# Altium schematic sheet LPEDT_revA1_bikeit_POWER.SchDoc: Bike It Power Management (part 2 of 3)
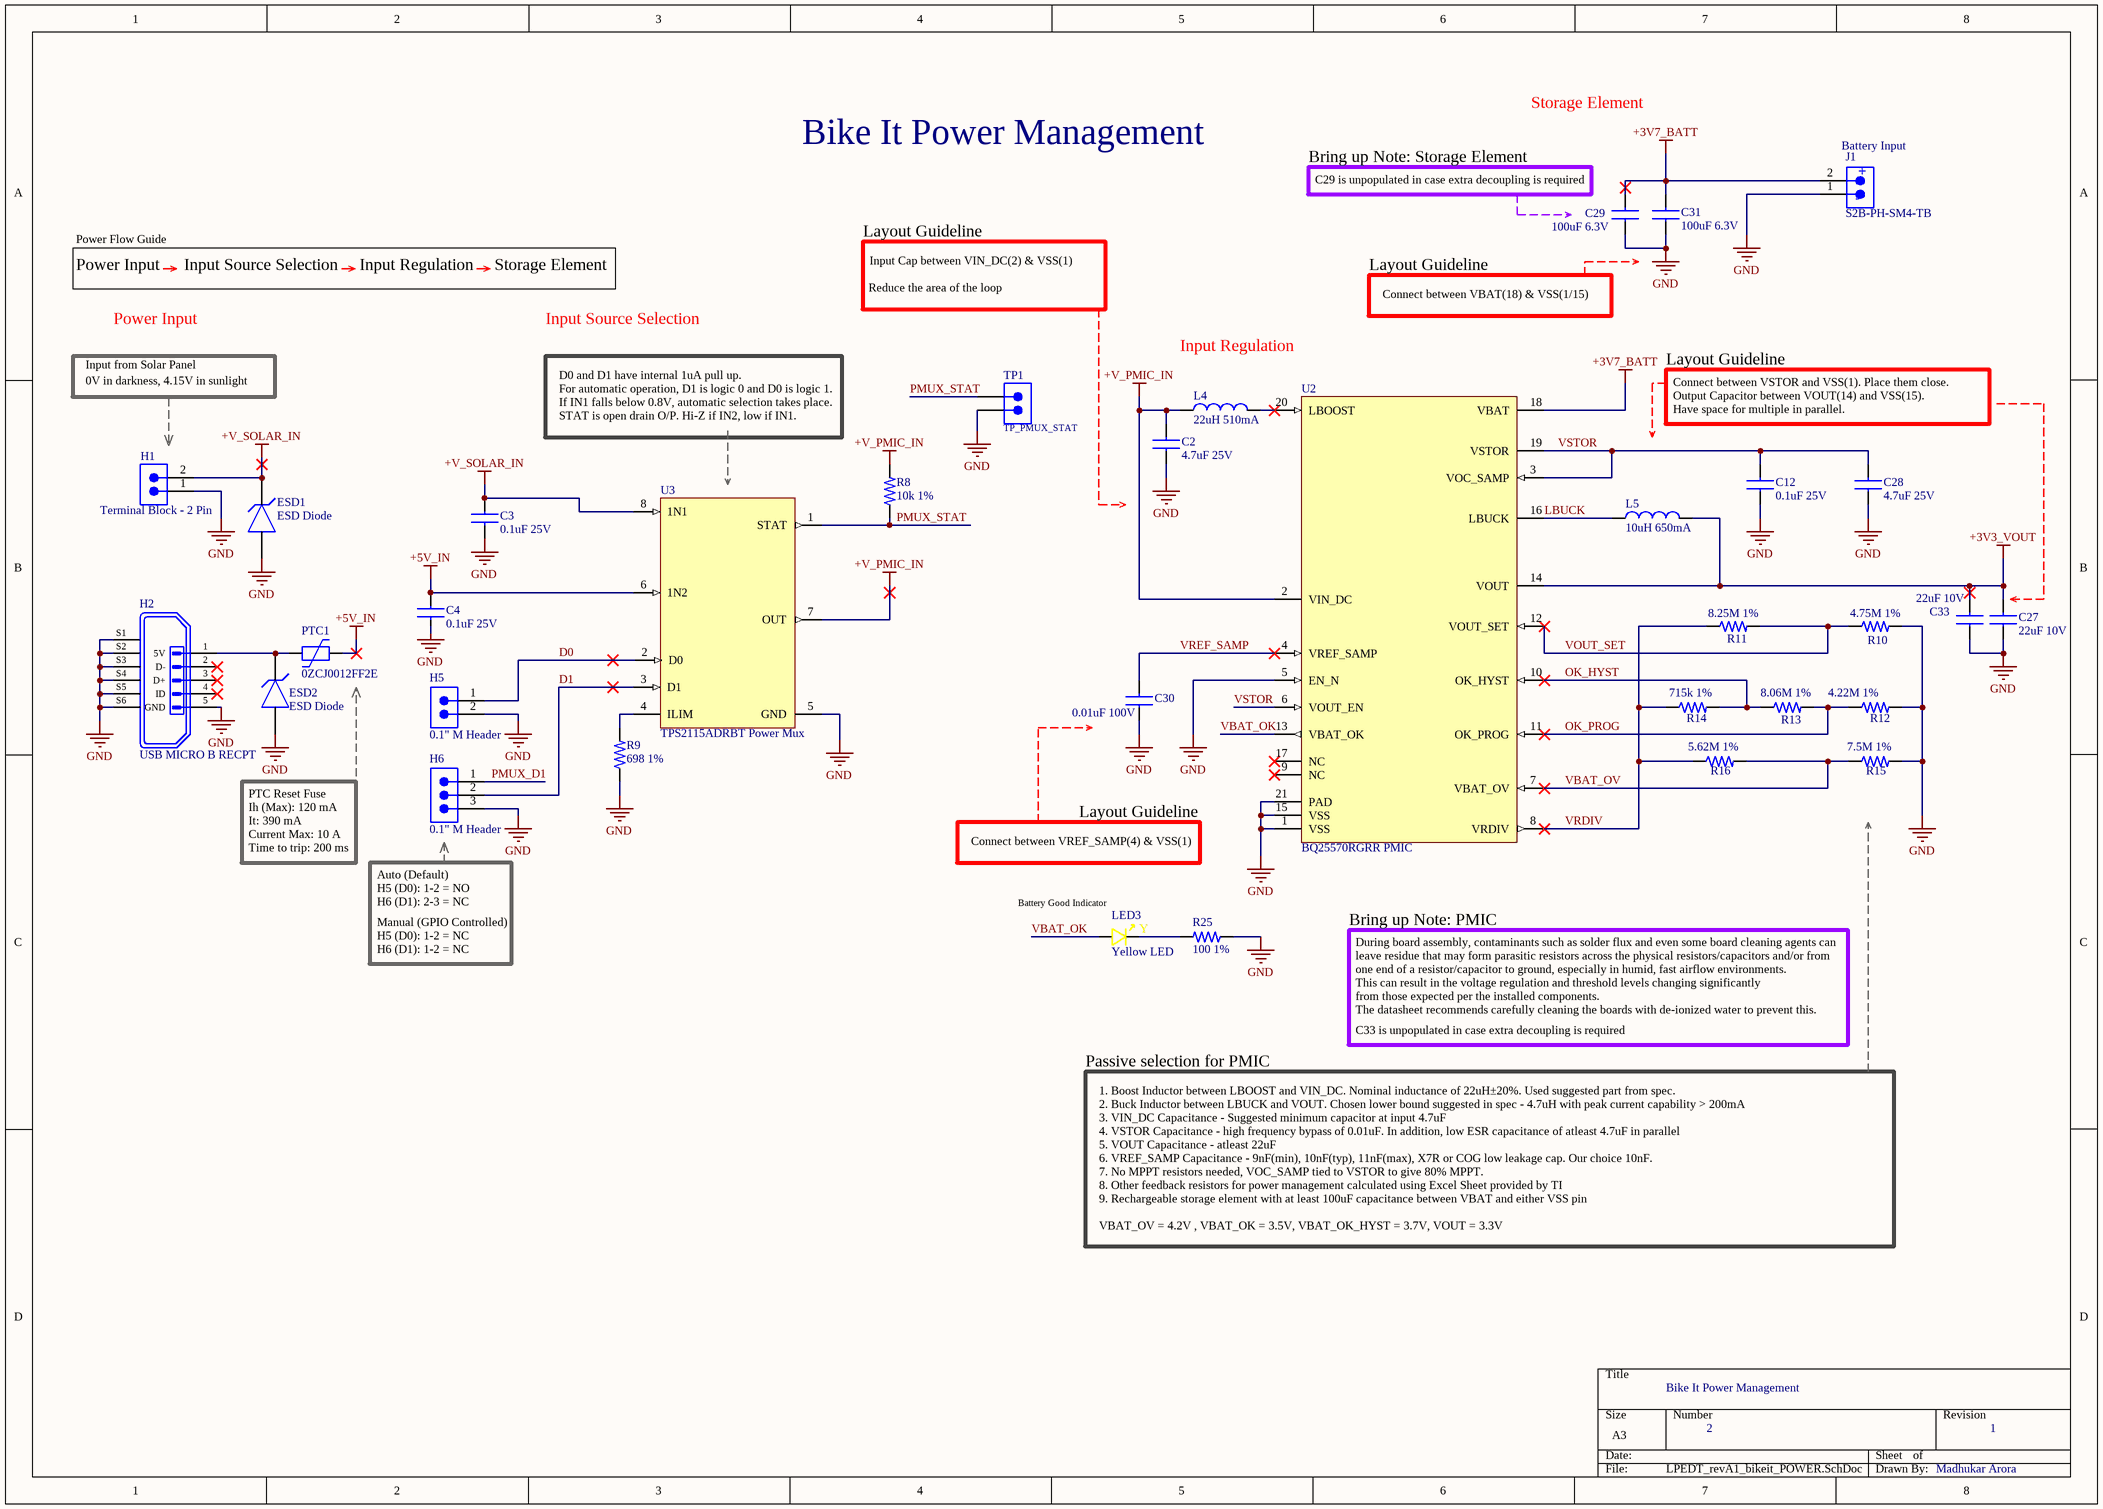
[diagram p1: LPEDT_revA1_bikeit_POWER.SchDoc]
## Library data of the parts
C2 C28 = GRM188R61E475KE11D: Cap Ceramic 0603 4.7 uF 25 V ±10 % Tolerance X5R SMT Multilayer Ceramic Capacitor; Manufacturer: Murata; Tolerance: 10%; Supplier 1: Digi-Key; Manufacturer Part Number: GRM188R61E475KE11D; RoHS: Yes; Category: Ceramic Capacitors; Stock 1: 307528; Pricing 1: 1=0.36000, 10=0.24700, 50=0.17280, 100=0.14820, 500=0.11112, 1000=0.09384 (USD); Mount: Surface Mount; Case/Package: 0603; Case Code (Metric): 1608; Case Code (Imperial): 0603; Material: Ceramic; Min Operating Temperature: -55°C; Max Operating Temperature: 85°C; Package Quantity: 4000; Packaging: Cut Tape; Capacitance: 4.7uF; Voltage Rating: 25V; Dielectric: X5R; Voltage: 25V; Voltage Rating (DC): 25V; Series: GRM; Length: 1.6mm; Width: 0.031inch; Height: 0.8mm; Thickness: 0.031inch; Depth: 0.8mm; REACH SVHC: No SVHC; Lead Free: Lead Free; RoHS Compliant: Yes; ComponentLink1URL: https://datasheet.ciiva.com/46444/1769893-46444982.pdf?src-supplier=Element14; ComponentLink1Description: https://datasheet.ciiva.com/46444/1769893-46444982.pdf?src-supplier=Element14; ComponentLink2URL: https://datasheet.ciiva.com/46444/1769893-46444983.pdf?src-supplier=Element14; ComponentLink2Description: https://datasheet.ciiva.com/46444/1769893-46444983.pdf?src-supplier=Element14; ComponentLink3URL: https://datasheet.ciiva.com/14891/partnumbering-e-01-14891103.pdf?src-supplier=Digi-Key; ComponentLink3Description: https://datasheet.ciiva.com/14891/partnumbering-e-01-14891103.pdf?src-supplier=Digi-Key; ComponentLink4URL: https://datasheet.ciiva.com/14891/partnumbering-e-01-14891102.pdf?src-supplier=Digi-Key; ComponentLink4Description: https://datasheet.ciiva.com/14891/partnumbering-e-01-14891102.pdf?src-supplier=Digi-Key; Supplier Part Number 1: 490-7203-1-ND
C3 C4 C12 = GCJ188R71E104KA12D: CAP CER 0.1UF 25V X7R 0603; Manufacturer: Murata; Capacitance: 100nF; Tolerance: 10%; Supplier 1: Mouser; Manufacturer Part Number: GCJ188R71E104KA12D; RoHS: Yes; Category: Ceramic Capacitors; Stock 1: 1672; Pricing 1: 1=0.21000, 10=0.14900, 50=0.08480, 100=0.07030, 500=0.04928, 1000=0.04080 (USD); Mount: Surface Mount; Case/Package: 0603; Case Code (Imperial): 0603; Case Code (Metric): 1608; Min Operating Temperature: -55°C; Max Operating Temperature: 125°C; Features: Soft Termination; Packaging: Tape and Reel; Voltage Rating: 25V; Ratings: AEC-Q200; RoHS Compliant: Yes; ComponentLink1URL: http://search.murata.co.jp/Ceramy/image/img/A01X/G101/ENG/GCJ188R71E104KA12-01.pdf?src-supplier=Digi-Key; ComponentLink1Description: http://search.murata.co.jp/Ceramy/image/img/A01X/G101/ENG/GCJ188R71E104KA12-01.pdf?src-supplier=Digi-Key; Supplier Part Number 1: 81-GCJ188R71E104KA2D
C27 C33 = GRM187R61A226ME15D: Cap Ceramic 0603 22 uF 10 V ±20% Tolerance X5R Multilayer Ceramic Chip Capacitor; Manufacturer: Murata; Manufacturer Part Number: GRM188R61A226ME15D; RoHS: Yes; Category: Ceramic Capacitors; Stock 1: 1378902; Pricing 1: 1=0.30000, 10=0.20500, 50=0.13680, 100=0.11630, 500=0.08210, 1000=0.07184 (USD); Mount: Surface Mount; Case/Package: 0603; Case Code (Metric): 1608; Case Code (Imperial): 0603; Material: Ceramic; Weight: 0.000222oz; Min Operating Temperature: -55°C; Max Operating Temperature: 85°C; Capacitance: 22uF; Tolerance: 20%; Voltage Rating: 10V; Packaging: Tape and Reel; Dielectric: X5R; Termination: SMD/SMT; Voltage Rating (DC): 10V; Package Quantity: 4000; Length: 1.6mm; Width: 0.8mm; Height: 0.8mm; Thickness: 0.039inch; Depth: 0.8mm; REACH SVHC: No SVHC; Lead Free: Lead Free; RoHS Compliant: Yes; ComponentLink1URL: https://datasheet.ciiva.com/46444/1769893-46444975.pdf?src-supplier=Element14; ComponentLink1Description: https://datasheet.ciiva.com/46444/1769893-46444975.pdf?src-supplier=Element14; Supplier 1: Digi-Key
C29 C31 = CL31A107MQHNNNE: Cap Ceramic 100uF 6.3V X5R 20% SMD 1206 85°C Embossed T/R; Manufacturer: Samsung; Supplier 1: Digi-Key; Manufacturer Part Number: CL31A107MQHNNNE; RoHS: Yes; Category: Ceramic Capacitors; Stock 1: 161626; Pricing 1: 1=0.57000, 10=0.40300, 50=0.30480, 100=0.26540, 500=0.19662, 1000=0.16713 (USD); Mount: Surface Mount; Case/Package: 1206; Case Code (Metric): 3216; Case Code (Imperial): 1206; Contact Plating: Tin; Material: Ceramic; Min Operating Temperature: -55°C; Max Operating Temperature: 85°C; Tolerance: 20%; Capacitance: 100uF; Dielectric: X5R; Packaging: Tape and Reel; Package Quantity: 2000; Voltage Rating: 6.3V; Voltage: 6.3V; Series: CL; Construction: Flat; Length: 3.2mm; Width: 0.063inch; Height: 1.6mm; Thickness: 0.071inch; Depth: 1.6mm; Radiation Hardening: No; RoHS Compliant: Yes; ComponentLink1URL: https://datasheet.ciiva.com/25723/cl31a107mqhnnne-25723159.pdf?src-supplier=Digi-Key; ComponentLink1Description: https://datasheet.ciiva.com/25723/cl31a107mqhnnne-25723159.pdf?src-supplier=Digi-Key; ComponentLink2URL: https://datasheet.ciiva.com/16437/cl31a107mqhnnne-16437212.pdf?src-supplier=Future+Electronics; ComponentLink2Description: https://datasheet.ciiva.com/16437/cl31a107mqhnnne-16437212.pdf?src-supplier=Future+Electronics; ComponentLink3URL: https://datasheet.ciiva.com/15195/getdatasheetpartid-358449-15195997.pdf?src-supplier=Verical; ComponentLink3Description: https://datasheet.ciiva.com/15195/getdatasheetpartid-358449-15195997.pdf?src-supplier=Verical; ComponentLink4URL: https://datasheet.ciiva.com/29201/452463-da-01-en-vs-kondensator-1206-29201265.pdf?src-supplier=Conrad; ComponentLink4Description: https://datasheet.ciiva.com/29201/452463-da-01-en-vs-kondensator-1206-29201265.pdf?src-supplier=Conrad; ComponentLink5URL: https://datasheet.ciiva.com/20173/71-0886-20173093.pdf?src-supplier=Rapid+Electronics; ComponentLink5Description: https://datasheet.ciiva.com/20173/71-0886-20173093.pdf?src-supplier=Rapid+Electronics
C30 = GCM188R72A103KA37D: Multilayer Ceramic Capacitor, AEC-Q200 GCM Series, 0.01 F, 10%, X7R, 100 V RoHS Compliant: Yes; Manufacturer: Murata; Manufacturer Part Number: GCM188R72A103KA37J; Capacitance: 10nF; Supplier 1: Digi-Key; RoHS: Yes; Category: Ceramic Capacitors; Stock 1: 112779; Pricing 1: 1=0.10000, 10=0.07400, 50=0.04060, 100=0.03310, 500=0.02364, 1000=0.01857 (USD); Mount: Surface Mount; Case/Package: 0603; Case Code (Imperial): 0603; Case Code (Metric): 1608; Min Operating Temperature: -55°C; Max Operating Temperature: 125°C; Tolerance: 10%; Voltage Rating: 100V; Packaging: Tape and Reel; Voltage Rating (DC): 100V; Package Quantity: 1; Dielectric: X7R; Termination: SMD/SMT; Voltage: 100V; Series: GCM; Construction: Flat; Length: 1.6mm; Width: 0.8mm; Height: 0.8mm; Thickness: 0.035inch; Depth: 0.8mm; Ratings: AEC-Q200; Radiation Hardening: No; REACH SVHC: No SVHC; Lead Free: Lead Free; RoHS Compliant: Yes; ComponentLink1URL: https://datasheet.ciiva.com/132/product-132907.pdf?src-supplier=Digi-Key; ComponentLink1Description: https://datasheet.ciiva.com/132/product-132907.pdf?src-supplier=Digi-Key; ComponentLink2URL: https://datasheet.ciiva.com/132/product-132909.pdf?src-supplier=Digi-Key; ComponentLink2Description: https://datasheet.ciiva.com/132/product-132909.pdf?src-supplier=Digi-Key; ComponentLink3URL: https://datasheet.ciiva.com/16497/product-16497251.pdf?src-supplier=Future+Electronics; ComponentLink3Description: https://datasheet.ciiva.com/16497/product-16497251.pdf?src-supplier=Future+Electronics; ComponentLink4URL: https://datasheet.ciiva.com/18183/getdatasheetpartid-178890-18183651.pdf?src-supplier=Verical; ComponentLink4Description: https://datasheet.ciiva.com/18183/getdatasheetpartid-178890-18183651.pdf?src-supplier=Verical; ComponentLink5URL: https://datasheet.ciiva.com/132/product-132908.pdf?src-supplier=Digi-Key; ComponentLink5Description: https://datasheet.ciiva.com/132/product-132908.pdf?src-supplier=Digi-Key; ComponentLink6URL: https://datasheet.ciiva.com/11786/0900766b80ef92d0-11786108.pdf?src-supplier=RSComponents; ComponentLink6Description: https://datasheet.ciiva.com/11786/0900766b80ef92d0-11786108.pdf?src-supplier=RSComponents; ComponentLink7URL: https://datasheet.ciiva.com/11619/product-11619719.pdf?src-supplier=Avnet; ComponentLink7Description: https://datasheet.ciiva.com/11619/product-11619719.pdf?src-supplier=Avnet; Supplier Part Number 1: 490-8028-1-ND
ESD1 ESD2 = SP1003-01ETG: ESD Suppressor Diode TVS Uni-Dir 5V Automotive 2-Pin SOD-882 T/R; Manufacturer: Littelfuse; Reverse Breakdown Voltage: 6V; Capacitance: 30pF; Max Surge Current: 7A; Number of Unidirectional Channels: 1; Clamping Voltage: 12V; Power Line Protection: No; Polarity: Bidirectional,Unidirectional; Test Current: 1mA; Leakage Current: 100nA; Diode Type: ZENER; Supplier 1: Digi-Key; Manufacturer Part Number: SP1003-01ETG; RoHS: Yes; Category: TVS Diodes; Stock 1: 9965; Pricing 1: 1=0.45000, 10=0.35100, 100=0.21040, 500=0.19478, 1000=0.13245, 2000=0.12193, 5000=0.11686 (USD); Mount: Surface Mount; Number of Pins: 2; Min Operating Temperature: -40°C; Max Operating Temperature: 85°C; Package Quantity: 3000; Packaging: Tape and Reel; Operating Supply Voltage: 5V; Reverse Standoff Voltage: 5V; Min Breakdown Voltage: 6V; Breakdown Voltage: 5V; Number of Channels: 1; Termination: SMD/SMT; Number of Elements: 1; Peak Pulse Current: 7A; Resistor Type: Zener; Series: Automotive, AEC-Q101, SP1003, SPA®; REACH SVHC: No SVHC; Lead Free: Lead Free; RoHS Compliant: Yes; ComponentLink1URL: https://datasheet.ciiva.com/4507/littelfuse-tvs-diode-array-spa-sp1003-221268-4507734.pdf?src-supplier=Mouser; ComponentLink1Description: https://datasheet.ciiva.com/4507/littelfuse-tvs-diode-array-spa-sp1003-221268-4507734.pdf?src-supplier=Mouser; ComponentLink2URL: https://datasheet.ciiva.com/16488/littelfuse-tvs-diode-array-spa-sp1003-16488471.pdf?src-supplier=Future+Electronics; ComponentLink2Description: https://datasheet.ciiva.com/16488/littelfuse-tvs-diode-array-spa-sp1003-16488471.pdf?src-supplier=Future+Electronics; ComponentLink3URL: https://datasheet.ciiva.com/330/littelfuse-tvs-diode-array-sp1003-datasheet-pdf-330594.pdf?src-supplier=Digi-Key; ComponentLink3Description: https://datasheet.ciiva.com/330/littelfuse-tvs-diode-array-sp1003-datasheet-pdf-330594.pdf?src-supplier=Digi-Key; ComponentLink4URL: https://datasheet.ciiva.com/330/littelfuse-tvs-diode-array-sp1003-datasheet-pdf-330595.pdf?src-supplier=Digi-Key; ComponentLink4Description: https://datasheet.ciiva.com/330/littelfuse-tvs-diode-array-sp1003-datasheet-pdf-330595.pdf?src-supplier=Digi-Key; ComponentLink5URL: https://datasheet.ciiva.com/330/littelfuse-tvs-diode-array-sp1003-datasheet-pdf-330596.pdf?src-supplier=Digi-Key; ComponentLink5Description: https://datasheet.ciiva.com/330/littelfuse-tvs-diode-array-sp1003-datasheet-pdf-330596.pdf?src-supplier=Digi-Key; ComponentLink6URL: https://datasheet.ciiva.com/1268/1854133-1268499.pdf?src-supplier=Element14; ComponentLink6Description: https://datasheet.ciiva.com/1268/1854133-1268499.pdf?src-supplier=Element14; Supplier Part Number 1: F4088CT-ND
H1 = 282834-2: TE CONNECTIVITY / BUCHANAN - 282834-2 - TERMINAL BLOCK, WIRE TO BRD, 2POS, 16AWG; Plating: Brass,Steel; Max Voltage Rating (AC): 150V; Number of Poles: 2; Gender: Male; Current Rating: 10A; Number of Levels: 1; Connector Type: Receptacle; Closed End: No (Without); Screwless Terminal Block: Yes (With); Wire Gauge (Max): 30AWG; Pitch: 2.54mm; Thread Size: M1.6; Tail Length: 3.4mm; Approvals: UL; Supplier 1: Digi-Key; Manufacturer: TE Connectivity; Manufacturer Part Number: 282834-2; RoHS: Yes; Category: Terminal Blocks; Stock 1: 20643; Pricing 1: 1=1.27000, 10=0.89500, 25=0.83440, 50=0.75740, 100=0.75410, 250=0.63676, 500=0.60324, 1000=0.53622, 5000=0.50270 (USD); Mount: Through Hole; Contact Plating: Tin; Contact Material: Brass; Color: Green; Material: Nylon; Housing Color: Green; Housing Material: Polyamide; Min Operating Temperature: -40°C; Max Operating Temperature: 105°C; Number of Rows: 1; Voltage Rating: 150V; Package Quantity: 300; Packaging: Bulk; Number of Positions: 2; Termination: Solder; Number of Positions Per Level: 2; Current: 10A; Voltage: 150V; Max Supply Voltage (AC): 150V; Number of Contacts: 2; Number of Circuits: 2; Orientation: Straight; Max Current Rating: 10A; Interlock: No (Without); Screw Flange: No (Without); Side Stackable: Yes (With); Series: Buchanan; Length: 5.54mm; Width: 6.5mm; Wire Gauge (Min): 30AWG; Wire/Cable Gauge: 30AWG; Depth: 6.5mm; Radiation Hardening: No; REACH SVHC: Unknown; ELV: Compliant; Lead Free: Lead Free; Flammability Rating: UL94 V-0; RoHS Compliant: Yes; ComponentLink1URL: https://datasheet.ciiva.com/11758/0900766b80e7dc96-11758675.pdf?src-supplier=RSComponents; ComponentLink1Description: https://datasheet.ciiva.com/11758/0900766b80e7dc96-11758675.pdf?src-supplier=RSComponents; ComponentLink2URL: https://datasheet.ciiva.com/16386/282834-2-16386363.pdf?src-supplier=Future+Electronics; ComponentLink2Description: https://datasheet.ciiva.com/16386/282834-2-16386363.pdf?src-supplier=Future+Electronics; ComponentLink3URL: https://datasheet.ciiva.com/14609/70086732-14609670.pdf?src-supplier=Allied+Electronics; ComponentLink3Description: https://datasheet.ciiva.com/14609/70086732-14609670.pdf?src-supplier=Allied+Electronics; ComponentLink4URL: https://datasheet.ciiva.com/15169/getdatasheetpartid-155864-15169558.pdf?src-supplier=Verical; ComponentLink4Description: https://datasheet.ciiva.com/15169/getdatasheetpartid-155864-15169558.pdf?src-supplier=Verical; ComponentLink5URL: https://datasheet.ciiva.com/16676/eng-cs-1308389-eurostyle-terminal-blocks-0607-16676126.pdf?src-supplier=Avnet+Europe; ComponentLink5Description: https://datasheet.ciiva.com/16676/eng-cs-1308389-eurostyle-terminal-blocks-0607-16676126.pdf?src-supplier=Avnet+Europe; ComponentLink6URL: https://datasheet.ciiva.com/30166/eng-cs-1308389-eurostyle-terminal-blocks-0607-30166974.pdf?src-supplier=Onlinecomponents.com; ComponentLink6Description: https://datasheet.ciiva.com/30166/eng-cs-1308389-eurostyle-terminal-blocks-0607-30166974.pdf?src-supplier=Onlinecomponents.com; ComponentLink7URL: https://datasheet.ciiva.com/3141/eng-cs-1308389-eurostyle-terminal-blocks-0607-3141115.pdf?src-supplier=Avnet; ComponentLink7Description: https://datasheet.ciiva.com/3141/eng-cs-1308389-eurostyle-terminal-blocks-0607-3141115.pdf?src-supplier=Avnet; ComponentLink8URL: https://datasheet.ciiva.com/823/eng-cd-282834-c1-823453.pdf?src-supplier=Digi-Key; ComponentLink8Description: https://datasheet.ciiva.com/823/eng-cd-282834-c1-823453.pdf?src-supplier=Digi-Key; Supplier Part Number 1: A98333-ND
H2 = 10118194-0001LF: USB - micro B USB 2.0 Receptacle Connector 5 Position Surface Mount, Right Angle; Through Hole; Manufacturer: Amphenol FCI; Number of Terminals/Pins: 5; Current Rating: 1.8A; Connector Type: USB,Receptacle; Insulation Resistance: 1GR; Number of Ports: 1; Max Voltage Rating (AC): 100V; Pitch: 0.65mm; Supplier 1: Digi-Key; Manufacturer Part Number: 10118194-0001LF; RoHS: Yes; Category: USB Connectors; Stock 1: 87961; Pricing 1: 1=0.48000, 10=0.45100, 25=0.38680, 50=0.32860, 100=0.31580, 250=0.28360, 500=0.27070 (USD); Mount: Surface Mount,Horizontal; Contact Material: Copper Alloy; Contact Plating: Gold; Housing Material: Polymer; Color: Black; Min Operating Temperature: -55°C; Max Operating Temperature: 85°C; Package Quantity: 9600; Packaging: Tape and Reel; Gender: Receptacle; Number of Contacts: 5; Termination: Solder; Orientation: Right Angle; Features: Shielded; Length: 8.05mm; Depth: 5mm; Radiation Hardening: No; Lead Free: Lead Free; Flammability Rating: UL94 V-0; ComponentLink1URL: https://datasheet.ciiva.com/4598/10118194ac-197217-4598807.pdf?src-supplier=Mouser; ComponentLink1Description: https://datasheet.ciiva.com/4598/10118194ac-197217-4598807.pdf?src-supplier=Mouser; ComponentLink2URL: https://datasheet.ciiva.com/26945/getdatasheetpartid-418619-26945695.pdf?src-supplier=Verical; ComponentLink2Description: https://datasheet.ciiva.com/26945/getdatasheetpartid-418619-26945695.pdf?src-supplier=Verical; ComponentLink3URL: https://datasheet.ciiva.com/851/10118194-851110.pdf?src-supplier=Digi-Key; ComponentLink3Description: https://datasheet.ciiva.com/851/10118194-851110.pdf?src-supplier=Digi-Key; ComponentLink4URL: https://datasheet.ciiva.com/851/10118194-851111.pdf?src-supplier=Digi-Key; ComponentLink4Description: https://datasheet.ciiva.com/851/10118194-851111.pdf?src-supplier=Digi-Key; Supplier Part Number 1: 609-4618-6-ND
H5 = PRPC002SAAN-RC: CONN HEADER VERT 2POS 2.54MM; Manufacturer: Sullins; Connector Type: Header, Unshrouded, Breakaway; Number of Positions: 2; Number of Positions Loaded: All; Pitch: 0.100" (2.54mm); Online Catalog: 0.100" (2.54mm) Pitch Connector Headers; Other Names: S9510E-02  S9510E-02-ND; Supplier 1: Digi-Key; Manufacturer Part Number: PRPC002SAAN-RC; Stock 1: 42739; Pricing 1: 1=0.08, 10=0.073, 25=0.054, 50=0.0464, 100=0.0449, 250=0.0387, 500=0.0372 (USD); Standard Package: 1; Category: Connectors, Interconnects; Family: Rectangular Connectors - Headers, Male Pins; Series: -; Packaging: Bulk; Contact Type: Male Pin; Number of Rows: 1; Row Spacing: -; Contact Mating Length: 0.230" (5.84mm); Mounting Type: Through Hole; Termination: Solder; Fastening Type: -; Features: -; Contact Finish: Gold; Contact Finish Thickness: Flash; Color: Black; ComponentLink1URL: https://media.digikey.com/PDF/Data%20Sheets/Sullins%20PDFs/xRxCzzzSxxN-RC_ST_11635-B.pdf?src-supplier=Digi-Key; ComponentLink1Description: https://media.digikey.com/PDF/Data%20Sheets/Sullins%20PDFs/xRxCzzzSxxN-RC_ST_11635-B.pdf?src-supplier=Digi-Key; Supplier Part Number 1: S1011EC-02-ND
H6 = PRPC003SAAN-RC: CONN HEADER VERT 3POS 2.54MM; Manufacturer: Sullins; Connector Type: Header, Unshrouded, Breakaway; Number of Positions: 3; Number of Positions Loaded: All; Pitch: 0.100" (2.54mm); Online Catalog: 0.100" (2.54mm) Pitch Connector Headers; Other Names: S9510E-03  S9510E-03-ND; Supplier 1: Digi-Key; Manufacturer Part Number: PRPC003SAAN-RC; Stock 1: 19067; Pricing 1: 1=0.12, 10=0.109, 25=0.0812, 50=0.0696, 100=0.0673, 250=0.058, 500=0.0557 (USD); Standard Package: 1; Category: Connectors, Interconnects; Family: Rectangular Connectors - Headers, Male Pins; Series: -; Packaging: Bulk; Contact Type: Male Pin; Number of Rows: 1; Row Spacing: -; Contact Mating Length: 0.230" (5.84mm); Mounting Type: Through Hole; Termination: Solder; Fastening Type: -; Features: -; Contact Finish: Gold; Contact Finish Thickness: Flash; Color: Black; ComponentLink1URL: https://media.digikey.com/PDF/Data%20Sheets/Sullins%20PDFs/xRxCzzzSxxN-RC_ST_11635-B.pdf?src-supplier=Digi-Key; ComponentLink1Description: https://media.digikey.com/PDF/Data%20Sheets/Sullins%20PDFs/xRxCzzzSxxN-RC_ST_11635-B.pdf?src-supplier=Digi-Key; Supplier Part Number 1: S1011EC-03-ND
J1 = S2B-PH-SM4-TB(LF)(SN): JST PH Series, 2 Position, Side Entry, 2.00mm, Solder, Surface Mount, Natural; Manufacturer: JST; Manufacturer Part Number: S2B-PH-SM4-TB(LF)(SN); Stock 1: 117838; Pricing 1: 1=0.58000, 10=0.54700, 100=0.41940, 500=0.36470 (USD); ComponentLink1URL: http://datasheet.octopart.com/S2B-PH-SM4-TB%28LF%29%28SN%29-JST-datasheet-10411123.pdf?src-supplier=Future+Electronics; ComponentLink1Description: http://datasheet.octopart.com/S2B-PH-SM4-TB%28LF%29%28SN%29-JST-datasheet-10411123.pdf?src-supplier=Future+Electronics; ComponentLink2URL: http://datasheet.octopart.com/S2B-PH-SM4-TB%28LF%29%28SN%29-JST-datasheet-8324864.pdf?src-supplier=Future+Electronics; ComponentLink2Description: http://datasheet.octopart.com/S2B-PH-SM4-TB%28LF%29%28SN%29-JST-datasheet-8324864.pdf?src-supplier=Future+Electronics; ComponentLink3URL: http://datasheet.octopart.com/S2B-PH-SM4-TB%28LF%29%28SN%29-JST-datasheet-15068535.pdf?src-supplier=Newark; ComponentLink3Description: http://datasheet.octopart.com/S2B-PH-SM4-TB%28LF%29%28SN%29-JST-datasheet-15068535.pdf?src-supplier=Newark; ComponentLink4URL: http://datasheet.octopart.com/S2B-PH-SM4-TB%28LF%29%28SN%29-JST-datasheet-56537.pdf?src-supplier=Future+Electronics; ComponentLink4Description: http://datasheet.octopart.com/S2B-PH-SM4-TB%28LF%29%28SN%29-JST-datasheet-56537.pdf?src-supplier=Future+Electronics; ComponentLink5URL: http://datasheet.octopart.com/S2B-PH-SM4-TB%28LF%29%28SN%29-JST-datasheet-515537.pdf?src-supplier=Farnell; ComponentLink5Description: http://datasheet.octopart.com/S2B-PH-SM4-TB%28LF%29%28SN%29-JST-datasheet-515537.pdf?src-supplier=Farnell; ComponentLink6URL: http://datasheet.octopart.com/S2B-PH-SM4-TB%28LF%29%28SN%29-JST-datasheet-12510261.pdf?src-supplier=Future+Electronics; ComponentLink6Description: http://datasheet.octopart.com/S2B-PH-SM4-TB%28LF%29%28SN%29-JST-datasheet-12510261.pdf?src-supplier=Future+Electronics; Supplier 1: Newark; Supplier Part Number 1: 38K8067
L4 = 744031220: Power Inductor (SMD), 22 µH, 510 mA, Shielded, 360 mA, WE-TPC Series, 3.8mm x 3.8mm x 1.65mm; Manufacturer: Wurth Electronics; Core Material: Ferrite; Tolerance: 30%; Self Resonant Frequency: 26MHz; Saturation Current: 360mA; DC Resistance (DCR): 450mR; Test Frequency: 100kHz; Supplier 1: Digi-Key; Manufacturer Part Number: 744031220; RoHS: Yes; Category: Fixed Inductors; Stock 1: 14781; Pricing 1: 1=1.43000, 10=1.38900, 50=1.21500, 100=1.11100, 500=0.98000 (USD); Mount: Surface Mount; Case/Package: Nonstandard; Number of Pins: 2; Weight: 0.003633oz; Min Operating Temperature: -40°C; Max Operating Temperature: 125°C; Packaging: Cut Tape; Package Quantity: 1000; Termination: SMD/SMT; Inductance: 22uH; Inductance Tolerance: 30%; Current Rating: 510mA; Shielding: Shielded; Resistor Type: Wirewound; Max DC Current: 510mA; RMS Current (Irms): 510mA; Series: WE-TPC; Length: 3.8mm; Width: 3.8mm; Height: 1.65mm; Height - Seated (Max): 0.071inch; Depth: 3.8mm; Lead Pitch: 1.1mm; RoHS Compliant: Yes; REACH SVHC: Unknown; Lead Free: Lead Free; ComponentLink1URL: https://datasheet.ciiva.com/11800/0900766b8079f7b9-11800353.pdf?src-supplier=RSComponents; ComponentLink1Description: https://datasheet.ciiva.com/11800/0900766b8079f7b9-11800353.pdf?src-supplier=RSComponents; ComponentLink2URL: https://datasheet.ciiva.com/7210/744031220-7210946.pdf?src-supplier=Newark; ComponentLink2Description: https://datasheet.ciiva.com/7210/744031220-7210946.pdf?src-supplier=Newark; ComponentLink3URL: https://datasheet.ciiva.com/4961/744031220-79613-4961173.pdf?src-supplier=Mouser; ComponentLink3Description: https://datasheet.ciiva.com/4961/744031220-79613-4961173.pdf?src-supplier=Mouser; ComponentLink4URL: https://datasheet.ciiva.com/1058/744031220-1058566.pdf?src-supplier=Digi-Key; ComponentLink4Description: https://datasheet.ciiva.com/1058/744031220-1058566.pdf?src-supplier=Digi-Key; ComponentLink5URL: https://datasheet.ciiva.com/1058/744031220-1058567.pdf?src-supplier=Digi-Key; ComponentLink5Description: https://datasheet.ciiva.com/1058/744031220-1058567.pdf?src-supplier=Digi-Key; ComponentLink6URL: https://datasheet.ciiva.com/7691/744031220-7691543.pdf?src-supplier=Element14; ComponentLink6Description: https://datasheet.ciiva.com/7691/744031220-7691543.pdf?src-supplier=Element14; ComponentLink7URL: https://datasheet.ciiva.com/14123/lp744031220-data-de-14123802.pdf?src-supplier=Distrelec; ComponentLink7Description: https://datasheet.ciiva.com/14123/lp744031220-data-de-14123802.pdf?src-supplier=Distrelec; Supplier Part Number 1: 732-1012-1-ND
L5 = 744029100: FIXED IND 10UH 650MA 470 MOHM; Manufacturer: Wurth Electronics; Manufacturer Part Number: 744025004; Core Material: Ferrite; Tolerance: 20%; Saturation Current: 1.7A; Shielding: Shielded; Current Rating: 1.35A; Inductance: 4.7uH; Self Resonant Frequency: 84MHz; DC Resistance (DCR): 120mR; Test Frequency: 100kHz; Series Resistance: 100mR; Supplier 1: Digi-Key; RoHS: Yes; Category: Fixed Inductors; Stock 1: 11683; Pricing 1: 1=1.54000, 10=1.48000, 50=1.36000, 100=1.13000, 250=1.02000 (USD); Mount: Surface Mount; Case/Package: Nonstandard; Number of Pins: 2; Min Operating Temperature: -40°C; Max Operating Temperature: 125°C; Packaging: Cut Tape; Package Quantity: 550; Resistor Type: Wirewound; Inductance Tolerance: 20%; Max DC Current: 1.35A; Termination: SMD/SMT; RMS Current (Irms): 1.35A; Length: 2.8mm; Width: 0.11inch; Height: 2.8mm; Height - Seated (Max): 0.118inch; Depth: 2.8mm; REACH SVHC: Unknown; ComponentLink1URL: https://datasheet.ciiva.com/6690/744025004-6690389.pdf?src-supplier=Digi-Key; ComponentLink1Description: https://datasheet.ciiva.com/6690/744025004-6690389.pdf?src-supplier=Digi-Key; ComponentLink2URL: https://datasheet.ciiva.com/11803/0900766b80f886b6-11803593.pdf?src-supplier=RSComponents; ComponentLink2Description: https://datasheet.ciiva.com/11803/0900766b80f886b6-11803593.pdf?src-supplier=RSComponents; ComponentLink3URL: https://datasheet.ciiva.com/4954/744025004-76625-4954718.pdf?src-supplier=Mouser; ComponentLink3Description: https://datasheet.ciiva.com/4954/744025004-76625-4954718.pdf?src-supplier=Mouser; ComponentLink4URL: https://datasheet.ciiva.com/6690/744025004-6690390.pdf?src-supplier=Digi-Key; ComponentLink4Description: https://datasheet.ciiva.com/6690/744025004-6690390.pdf?src-supplier=Digi-Key; ComponentLink5URL: https://datasheet.ciiva.com/14123/744025004-eng-tds-14123830.pdf?src-supplier=Distrelec; ComponentLink5Description: https://datasheet.ciiva.com/14123/744025004-eng-tds-14123830.pdf?src-supplier=Distrelec; ComponentLink6URL: https://datasheet.ciiva.com/6690/744025004-6690391.pdf?src-supplier=Digi-Key; ComponentLink6Description: https://datasheet.ciiva.com/6690/744025004-6690391.pdf?src-supplier=Digi-Key; ComponentLink7URL: https://datasheet.ciiva.com/7650/1243426-7650570.pdf?src-supplier=Element14; ComponentLink7Description: https://datasheet.ciiva.com/7650/1243426-7650570.pdf?src-supplier=Element14; Supplier Part Number 1: 732-1091-1-ND
LED3 = 150060YS75000: WURTH ELEKTRONIK - 150060YS75000 - LED, Yellow, SMD, 0603, 30 mA, 2 V, 590 nm; Manufacturer: Wurth Electronics; Viewing Angle: 140°; Lens Style: Clear,Rectangular; Wavelength: 590nm; Luminous Intensity: 120mcd; Forward Voltage: 2V; Forward Current: 30mA; Test Current: 20mA; Manufacturer Part Number: 150060YS75000; RoHS: Yes; Category: LEDs; Stock 1: 44523; Pricing 1: 1=0.14000, 50=0.13300, 100=0.11400, 500=0.09990 (USD); Mount: Surface Mount; Case/Package: 0603; Color: Yellow; Case Code (Metric): 1608; Case Code (Imperial): 0603; Min Operating Temperature: -40°C; Max Operating Temperature: 85°C; Package Quantity: 4000; Packaging: Tape and Reel; Dominant Wavelength: 590nm; Length: 1.6mm; Width: 0.8mm; Height: 0.7mm; REACH SVHC: Unknown; RoHS Compliant: Yes; ComponentLink1URL: https://datasheet.ciiva.com/23843/150060ys75000-23843250.pdf?src-supplier=Newark; ComponentLink1Description: https://datasheet.ciiva.com/23843/150060ys75000-23843250.pdf?src-supplier=Newark; ComponentLink2URL: https://datasheet.ciiva.com/29279/759432-da-01-en-chipled-0603-w-kl-gelb-150060ys75000-29279206.pdf?src-supplier=Conrad; ComponentLink2Description: https://datasheet.ciiva.com/29279/759432-da-01-en-chipled-0603-w-kl-gelb-150060ys75000-29279206.pdf?src-supplier=Conrad; ComponentLink3URL: https://datasheet.ciiva.com/29563/150060ys75000-29563045.pdf?src-supplier=Digi-Key; ComponentLink3Description: https://datasheet.ciiva.com/29563/150060ys75000-29563045.pdf?src-supplier=Digi-Key; ComponentLink4URL: https://datasheet.ciiva.com/22656/1911348-22656951.pdf?src-supplier=Element14; ComponentLink4Description: https://datasheet.ciiva.com/22656/1911348-22656951.pdf?src-supplier=Element14; ComponentLink5URL: https://datasheet.ciiva.com/29563/150060ys75000-29563033.pdf?src-supplier=Digi-Key; ComponentLink5Description: https://datasheet.ciiva.com/29563/150060ys75000-29563033.pdf?src-supplier=Digi-Key; ComponentLink6URL: https://datasheet.ciiva.com/48430/150060ys75000-eng-tds-48430044.pdf?src-supplier=Distrelec; ComponentLink6Description: https://datasheet.ciiva.com/48430/150060ys75000-eng-tds-48430044.pdf?src-supplier=Distrelec; Supplier 1: Digi-Key; Supplier Part Number 1: 732-4981-1-ND
PTC1 = 0ZCJ0012FF2E: PTC Resettable Fuse 0.12A(hold) 0.39A(trip) 48VDC 10A 0.6W 0.2s 1.4Ohm SMD Solder Pad 1206 T/R Automotive; Manufacturer: Bel; Hold Current: 120mA; Trip Current: 390mA; Supplier 1: Digi-Key; Manufacturer Part Number: 0ZCJ0012FF2E; RoHS: Yes; Category: PTC Resettable Fuses; Stock 1: 187177; Pricing 1: 1=0.11000, 5=0.10800, 10=0.10400, 50=0.09280, 100=0.08640, 250=0.07680, 500=0.06400, 1000=0.06080 (USD); Case/Package: 1206; Case Code (Metric): 3216; Case Code (Imperial): 1206; Package Quantity: 1; Packaging: Tape and Reel; Max Current Rating: 10A; Time to Trip: 0.2s; Lead Free: Lead Free; RoHS Compliant: Yes; ComponentLink1URL: https://datasheet.ciiva.com/18550/0zcj-18550533.pdf?src-supplier=Digi-Key; ComponentLink1Description: https://datasheet.ciiva.com/18550/0zcj-18550533.pdf?src-supplier=Digi-Key; Supplier Part Number 1: 507-1795-1-ND
R8 = RC0603FR-0710KL: RES SMD 10k 1% 1/10W 0603; Manufacturer: Yageo; Resistance: 10kR; Temperature Coefficient: 100ppm/°C; Voltage Rating (DC): 50V; Power Rating: 100mW; Voltage Rating: 75V; Supplier 1: Digi-Key; Manufacturer Part Number: RC0603FR-0710KL; RoHS: Yes; Category: Chip SMD Resistors; Stock 1: 20705079; Pricing 1: 1=0.10000, 10=0.02300, 100=0.00930, 1000=0.00417, 2500=0.00362 (USD); Case/Package: 0603; Number of Pins: 2; Case Code (Imperial): 0603; Case Code (Metric): 1608; Size Code: 0603; Weight: 7.1E-05oz; Min Operating Temperature: -55°C; Max Operating Temperature: 155°C; Packaging: Tape and Reel; Tolerance: 1%; Resistor Type: Thick Film; Termination: SMD/SMT; Features: Moisture Resistant; Series: RC; Max Power Dissipation: 100mW; Number of Terminations: 2; Resistance Tolerance: 1%; Construction: Rectangular; Length: 1.6mm; Width: 0.8mm; Height: 0.45mm; Depth: 0.8mm; Lead Pitch: 0.3mm; REACH SVHC: Unknown; Lead Free: Lead Free; Military Standard: Not; RoHS Compliant: Yes; ComponentLink1URL: https://datasheet.ciiva.com/7660/38590-7660789.pdf?src-supplier=Element14; ComponentLink1Description: https://datasheet.ciiva.com/7660/38590-7660789.pdf?src-supplier=Element14; ComponentLink2URL: https://datasheet.ciiva.com/15189/getdatasheetpartid-409289-15189591.pdf?src-supplier=Verical; ComponentLink2Description: https://datasheet.ciiva.com/15189/getdatasheetpartid-409289-15189591.pdf?src-supplier=Verical; ComponentLink3URL: https://datasheet.ciiva.com/46440/1868787-46440891.pdf?src-supplier=Element14; ComponentLink3Description: https://datasheet.ciiva.com/46440/1868787-46440891.pdf?src-supplier=Element14; ComponentLink4URL: https://datasheet.ciiva.com/7983/443971-7983596.pdf?src-supplier=Element14; ComponentLink4Description: https://datasheet.ciiva.com/7983/443971-7983596.pdf?src-supplier=Element14; ComponentLink5URL: https://datasheet.ciiva.com/7746/1738695-7746239.pdf?src-supplier=Element14; ComponentLink5Description: https://datasheet.ciiva.com/7746/1738695-7746239.pdf?src-supplier=Element14; ComponentLink6URL: https://datasheet.ciiva.com/22747/443971-22747519.pdf?src-supplier=Element14; ComponentLink6Description: https://datasheet.ciiva.com/22747/443971-22747519.pdf?src-supplier=Element14; Supplier Part Number 1: 311-10.0KHRCT-ND
R9 = ERJ-3EKF6980V: RES SMD 698 1% 1/10W 0603; Manufacturer: Panasonic; Resistance: 698R; Power Rating: 100mW; Voltage Rating: 75V; Temperature Coefficient: 100ppm/°C; Voltage Rating (DC): 50V; Supplier 1: Digi-Key; Manufacturer Part Number: ERJ-3EKF6980V; RoHS: Yes; Category: Chip SMD Resistors; Stock 1: 57677; Pricing 1: 1=0.10000, 10=0.03500, 100=0.01430, 1000=0.00641, 2500=0.00557 (USD); Mount: Surface Mount; Case/Package: 0603; Case Code (Metric): 1608; Case Code (Imperial): 0603; Contact Plating: Tin; Min Operating Temperature: -55°C; Max Operating Temperature: 155°C; Tolerance: 1%; Packaging: Tape and Reel; Package Quantity: 1; Resistor Type: Thick Film; Number of Terminations: 2; Max Power Dissipation: 100mW; Features: Automotive AEC-Q200; Series: ERJ; Resistance Tolerance: 1%; Construction: Rectangular; Termination: SMD/SMT; Technology: THICK FILM; Length: 1.6mm; Width: 0.031inch; Height: 0.45mm; Depth: 0.8mm; Radiation Hardening: No; REACH SVHC: No SVHC; Military Standard: Not; Lead Free: Lead Free; RoHS Compliant: Yes; ComponentLink1URL: https://datasheet.ciiva.com/30063/aoa0000ce2-30063926.pdf?src-supplier=Onlinecomponents.com; ComponentLink1Description: https://datasheet.ciiva.com/30063/aoa0000ce2-30063926.pdf?src-supplier=Onlinecomponents.com; ComponentLink2URL: https://datasheet.ciiva.com/28547/1678782-28547032.pdf?src-supplier=Element14; ComponentLink2Description: https://datasheet.ciiva.com/28547/1678782-28547032.pdf?src-supplier=Element14; ComponentLink3URL: https://datasheet.ciiva.com/9180/aoa0000ce2-9180329.pdf?src-supplier=Avnet; ComponentLink3Description: https://datasheet.ciiva.com/9180/aoa0000ce2-9180329.pdf?src-supplier=Avnet; ComponentLink4URL: https://datasheet.ciiva.com/28694/1678782-28694457.pdf?src-supplier=Element14; ComponentLink4Description: https://datasheet.ciiva.com/28694/1678782-28694457.pdf?src-supplier=Element14; ComponentLink5URL: https://datasheet.ciiva.com/16774/70260748-16774443.pdf?src-supplier=Allied+Electronics; ComponentLink5Description: https://datasheet.ciiva.com/16774/70260748-16774443.pdf?src-supplier=Allied+Electronics; ComponentLink6URL: https://datasheet.ciiva.com/46378/426256-46378109.pdf?src-supplier=Element14; ComponentLink6Description: https://datasheet.ciiva.com/46378/426256-46378109.pdf?src-supplier=Element14; Supplier Part Number 1: P698HCT-ND
R10 = RC0603FR-074M75L: RES SMD 4.75M 1% 1/10W 0603; Manufacturer: Yageo; Resistance: 4.75MR; Power Rating: 100mW; Voltage Rating: 75V; Temperature Coefficient: 100ppm/°C; Voltage Rating (DC): 50V; Supplier 1: Digi-Key; Manufacturer Part Number: RC0603FR-074M75L; RoHS: Yes; Category: Chip SMD Resistors; Stock 1: 168754; Pricing 1: 1=0.10000, 10=0.02300, 100=0.00930, 1000=0.00417, 2500=0.00362 (USD); Case/Package: 0603; Case Code (Metric): 1608; Case Code (Imperial): 0603; Weight: 7.1E-05oz; Min Operating Temperature: -55°C; Max Operating Temperature: 155°C; Package Quantity: 1; Tolerance: 1%; Packaging: Tape and Reel; Resistor Type: Thick Film; Number of Terminations: 2; Termination: SMD/SMT; Max Power Dissipation: 100mW; Features: Moisture Resistant; Series: RC; Construction: Rectangular; Length: 1.6mm; Width: 0.031inch; Height: 0.022inch; Depth: 0.8mm; Military Standard: Not; Lead Free: Lead Free; RoHS Compliant: Yes; ComponentLink1URL: https://datasheet.ciiva.com/2455/pyu-r-int-thick-7-2455038.pdf?src-supplier=Digi-Key; ComponentLink1Description: https://datasheet.ciiva.com/2455/pyu-r-int-thick-7-2455038.pdf?src-supplier=Digi-Key; ComponentLink2URL: https://datasheet.ciiva.com/2455/pyu-r-int-thick-7-2455039.pdf?src-supplier=Digi-Key; ComponentLink2Description: https://datasheet.ciiva.com/2455/pyu-r-int-thick-7-2455039.pdf?src-supplier=Digi-Key; ComponentLink3URL: https://datasheet.ciiva.com/2455/pyu-r-int-thick-7-2455040.pdf?src-supplier=Digi-Key; ComponentLink3Description: https://datasheet.ciiva.com/2455/pyu-r-int-thick-7-2455040.pdf?src-supplier=Digi-Key
R11 = CRCW06038M25FKEA: RES SMD 8.25M  1% 1/10W 0603; Manufacturer: Vishay; Resistance: 8.25MR; Power Rating: 100mW; Voltage Rating: 75V; Temperature Coefficient: 100ppm/°C; Supplier 1: Digi-Key; Manufacturer Part Number: CRCW06038M25FKEA; RoHS: Yes; Category: Chip SMD Resistors; Stock 1: 13070; Pricing 1: 1=0.10000, 10=0.03400, 100=0.01390, 1000=0.00624, 2500=0.00542 (USD); Case/Package: 0603; Weight: 7.1E-05oz; Case Code (Metric): 1608; Case Code (Imperial): 0603; Contact Plating: Tin; Min Operating Temperature: -55°C; Max Operating Temperature: 155°C; Tolerance: 1%; Packaging: Tape and Reel; Package Quantity: 10; Resistor Type: Thick Film; Number of Terminations: 2; Termination: SMD/SMT; Max Power Dissipation: 100mW; Voltage Rating (DC): 75V; Features: Automotive AEC-Q200; Series: CRCW; Construction: Rectangular; Resistance Tolerance: 1%; Length: 1.55mm; Width: 0.033inch; Height: 0.02inch; Depth: 0.85mm; Radiation Hardening: No; REACH SVHC: Unknown; Military Standard: Not; Lead Free: Lead Free; RoHS Compliant: Yes; ComponentLink1URL: https://datasheet.ciiva.com/2513/dcrcwe3-2513731.pdf?src-supplier=Digi-Key; ComponentLink1Description: https://datasheet.ciiva.com/2513/dcrcwe3-2513731.pdf?src-supplier=Digi-Key; ComponentLink2URL: https://datasheet.ciiva.com/2513/dcrcwe3-2513732.pdf?src-supplier=Digi-Key; ComponentLink2Description: https://datasheet.ciiva.com/2513/dcrcwe3-2513732.pdf?src-supplier=Digi-Key; ComponentLink3URL: https://datasheet.ciiva.com/2513/dcrcwe3-2513733.pdf?src-supplier=Digi-Key; ComponentLink3Description: https://datasheet.ciiva.com/2513/dcrcwe3-2513733.pdf?src-supplier=Digi-Key; ComponentLink4URL: https://datasheet.ciiva.com/7748/1697337-7748717.pdf?src-supplier=Element14; ComponentLink4Description: https://datasheet.ciiva.com/7748/1697337-7748717.pdf?src-supplier=Element14; ComponentLink5URL: https://datasheet.ciiva.com/7748/1697337-7748718.pdf?src-supplier=Element14; ComponentLink5Description: https://datasheet.ciiva.com/7748/1697337-7748718.pdf?src-supplier=Element14; Supplier Part Number 1: 541-8.25MHCT-ND
R12 = CRCW06034M22FKEA: RES SMD 4.22M 1% 1/10W 0603; Manufacturer: Vishay; Power Rating: 100mW; Voltage Rating: 75V; Resistance: 4.22MR; Temperature Coefficient: 100ppm/°C; Supplier 1: Digi-Key; Manufacturer Part Number: CRCW06034M22FKEA; RoHS: Yes; Category: Chip SMD Resistors; Stock 1: 3556; Pricing 1: 1=0.10000, 10=0.03400, 100=0.01390, 1000=0.00624, 2500=0.00542 (USD); Case/Package: 0603; Number of Pins: 2; Weight: 7.1E-05oz; Case Code (Metric): 1608; Case Code (Imperial): 0603; Contact Plating: Tin; Min Operating Temperature: -55°C; Max Operating Temperature: 155°C; Tolerance: 1%; Packaging: Tape and Reel; Package Quantity: 10; Resistor Type: Thick Film; Number of Terminations: 2; Termination: SMD/SMT; Max Power Dissipation: 100mW; Voltage Rating (DC): 75V; Features: Automotive AEC-Q200; Series: CRCW; Construction: Rectangular; Resistance Tolerance: 1%; Length: 1.55mm; Width: 0.033inch; Height: 0.02inch; Depth: 0.85mm; Radiation Hardening: No; REACH SVHC: Unknown; Military Standard: Not; Lead Free: Lead Free; RoHS Compliant: Yes; ComponentLink1URL: https://datasheet.ciiva.com/2466/dcrcwe3-2466710.pdf?src-supplier=Digi-Key; ComponentLink1Description: https://datasheet.ciiva.com/2466/dcrcwe3-2466710.pdf?src-supplier=Digi-Key; ComponentLink2URL: https://datasheet.ciiva.com/2466/dcrcwe3-2466711.pdf?src-supplier=Digi-Key; ComponentLink2Description: https://datasheet.ciiva.com/2466/dcrcwe3-2466711.pdf?src-supplier=Digi-Key; ComponentLink3URL: https://datasheet.ciiva.com/9074/dcrcwe3-9074039.pdf?src-supplier=Avnet; ComponentLink3Description: https://datasheet.ciiva.com/9074/dcrcwe3-9074039.pdf?src-supplier=Avnet; ComponentLink4URL: https://datasheet.ciiva.com/2466/dcrcwe3-2466712.pdf?src-supplier=Digi-Key; ComponentLink4Description: https://datasheet.ciiva.com/2466/dcrcwe3-2466712.pdf?src-supplier=Digi-Key; ComponentLink5URL: https://datasheet.ciiva.com/5552/dcrcwe3-109170-5552601.pdf?src-supplier=Mouser; ComponentLink5Description: https://datasheet.ciiva.com/5552/dcrcwe3-109170-5552601.pdf?src-supplier=Mouser; ComponentLink6URL: https://datasheet.ciiva.com/3257/dcrcwe3-3257678.pdf?src-supplier=Avnet; ComponentLink6Description: https://datasheet.ciiva.com/3257/dcrcwe3-3257678.pdf?src-supplier=Avnet; ComponentLink7URL: https://datasheet.ciiva.com/22676/1700796-22676079.pdf?src-supplier=Element14; ComponentLink7Description: https://datasheet.ciiva.com/22676/1700796-22676079.pdf?src-supplier=Element14; Supplier Part Number 1: 541-4.22MHCT-ND
R13 = RMCF0603FT8M06: RES SMD 8.06M OHM 1% 1/10W 0603; Manufacturer: Stackpole Electronics; Resistance: 8.06MR; Temperature Coefficient: 200ppm/°C; Supplier 1: Digi-Key; Manufacturer Part Number: RMCF0603FT8M06; RoHS: Yes; Category: Chip SMD Resistors; Stock 1: 5987; Pricing 1: 1=0.10000, 10=0.02400, 100=0.00970, 1000=0.00437, 2500=0.00380 (USD); Mount: Surface Mount; Case/Package: 0603; Contact Plating: Tin,Matte; Min Operating Temperature: -55°C; Max Operating Temperature: 155°C; Packaging: Tape and Reel; Tolerance: 1%; Resistor Type: Thick Film; Radiation Hardening: No; RoHS Compliant: Yes; ComponentLink1URL: https://www.seielect.com/catalog/SEI-RMCF_RMCP.pdf?src-supplier=Avnet; ComponentLink1Description: https://www.seielect.com/catalog/SEI-RMCF_RMCP.pdf?src-supplier=Avnet; ComponentLink2URL: https://www.seielect.com/catalog/SEI-Packaging.pdf?src-supplier=Digi-Key; ComponentLink2Description: https://www.seielect.com/catalog/SEI-Packaging.pdf?src-supplier=Digi-Key; ComponentLink3URL: https://www.seielect.com/catalog/sei-rmcf_rmcp.pdf?src-supplier=Digi-Key; ComponentLink3Description: https://www.seielect.com/catalog/sei-rmcf_rmcp.pdf?src-supplier=Digi-Key; Supplier Part Number 1: RMCF0603FT8M06CT-ND
R14 = RC0603FR-07715KL: RES SMD 715k 1% 1/10W 0603; Manufacturer: Yageo; Resistance: 715kR; Power Rating: 100mW; Temperature Coefficient: 100ppm/°C; Voltage Rating (DC): 50V; Supplier 1: Digi-Key; Manufacturer Part Number: RC0603FR-07715KL; RoHS: Yes; Category: Chip SMD Resistors; Stock 1: 77861; Pricing 1: 1=0.10000, 10=0.02300, 100=0.00930, 1000=0.00417, 2500=0.00362 (USD); Case/Package: 0603; Case Code (Imperial): 0603; Size Code: 0603; Contact Plating: Tin,Matte; Min Operating Temperature: -55°C; Max Operating Temperature: 155°C; Tolerance: 1%; Packaging: Tape and Reel; Resistor Type: Thick Film; Number of Terminations: 2; Max Power Dissipation: 100mW; Features: Moisture Resistant; Series: RC; Package Quantity: 1; Construction: Rectangular; Length: 0.063inch; Width: 0.031inch; Height: 0.022inch; Depth: 0.8mm; Lead Free: Lead Free; RoHS Compliant: Yes; Military Standard: Not; ComponentLink1URL: https://datasheet.ciiva.com/2454/pyu-r-int-thick-7-2454995.pdf?src-supplier=Digi-Key; ComponentLink1Description: https://datasheet.ciiva.com/2454/pyu-r-int-thick-7-2454995.pdf?src-supplier=Digi-Key; ComponentLink2URL: https://datasheet.ciiva.com/28388/pyu-rc0603-51-rohs-l-4-28388367.pdf?src-supplier=Avnet+Europe; ComponentLink2Description: https://datasheet.ciiva.com/28388/pyu-rc0603-51-rohs-l-4-28388367.pdf?src-supplier=Avnet+Europe; Supplier Part Number 1: 311-715KHRCT-ND
R15 = CRCW06037M50FKEA: RES SMD 7.5M 1% 1/10W 0603; Manufacturer: Vishay; Resistance: 7.5MR; Power Rating: 100mW; Voltage Rating: 75V; Temperature Coefficient: 100ppm/°C; Supplier 1: Digi-Key; Manufacturer Part Number: CRCW06037M50FKEA; RoHS: Yes; Category: Chip SMD Resistors; Stock 1: 25524; Pricing 1: 1=0.10000, 10=0.03400, 100=0.01390, 1000=0.00624, 2500=0.00542 (USD); Case/Package: 0603; Number of Pins: 2; Weight: 7.1E-05oz; Case Code (Metric): 1608; Case Code (Imperial): 0603; Contact Plating: Tin; Min Operating Temperature: -55°C; Max Operating Temperature: 155°C; Resistor Type: Thick Film; Package Quantity: 10; Tolerance: 1%; Packaging: Tape and Reel; Number of Terminations: 2; Termination: Solder; Max Power Dissipation: 100mW; Voltage Rating (DC): 75V; Features: Automotive AEC-Q200; Series: CRCW; Resistance Tolerance: 1%; Technology: THICK FILM; Construction: Rectangular; Length: 1.55mm; Width: 0.033inch; Height: 0.45mm; Depth: 0.85mm; REACH SVHC: Unknown; Military Standard: Not; Lead Free: Lead Free; RoHS Compliant: Yes; ComponentLink1URL: https://datasheet.ciiva.com/2494/dcrcwe3-2494736.pdf?src-supplier=Digi-Key; ComponentLink1Description: https://datasheet.ciiva.com/2494/dcrcwe3-2494736.pdf?src-supplier=Digi-Key; ComponentLink2URL: https://datasheet.ciiva.com/2494/dcrcwe3-2494737.pdf?src-supplier=Digi-Key; ComponentLink2Description: https://datasheet.ciiva.com/2494/dcrcwe3-2494737.pdf?src-supplier=Digi-Key; ComponentLink3URL: https://datasheet.ciiva.com/5552/dcrcwe3-109170-5552646.pdf?src-supplier=Mouser; ComponentLink3Description: https://datasheet.ciiva.com/5552/dcrcwe3-109170-5552646.pdf?src-supplier=Mouser; ComponentLink4URL: https://datasheet.ciiva.com/22869/70201119-22869559.pdf?src-supplier=Allied+Electronics; ComponentLink4Description: https://datasheet.ciiva.com/22869/70201119-22869559.pdf?src-supplier=Allied+Electronics; ComponentLink5URL: https://datasheet.ciiva.com/16784/70201119-16784828.pdf?src-supplier=Allied+Electronics; ComponentLink5Description: https://datasheet.ciiva.com/16784/70201119-16784828.pdf?src-supplier=Allied+Electronics; ComponentLink6URL: https://datasheet.ciiva.com/2494/dcrcwe3-2494735.pdf?src-supplier=Digi-Key; ComponentLink6Description: https://datasheet.ciiva.com/2494/dcrcwe3-2494735.pdf?src-supplier=Digi-Key; ComponentLink7URL: https://datasheet.ciiva.com/22704/1697337-22704015.pdf?src-supplier=Element14; ComponentLink7Description: https://datasheet.ciiva.com/22704/1697337-22704015.pdf?src-supplier=Element14; Supplier Part Number 1: 541-7.50MHCT-ND
R16 = CRCW06035M62FKEA: RES SMD 5.62M 1% 1/10W 0603; Manufacturer: Vishay; Power Rating: 100mW; Voltage Rating: 75V; Resistance: 5.62MR; Temperature Coefficient: 100ppm/°C; Supplier 1: Digi-Key; Manufacturer Part Number: CRCW06035M62FKEA; RoHS: Yes; Category: Chip SMD Resistors; Stock 1: 31807; Pricing 1: 1=0.10000, 10=0.03400, 100=0.01390, 1000=0.00624, 2500=0.00542 (USD); Case/Package: 0603; Number of Pins: 2; Weight: 7.1E-05oz; Case Code (Metric): 1608; Case Code (Imperial): 0603; Contact Plating: Tin; Min Operating Temperature: -55°C; Max Operating Temperature: 155°C; Tolerance: 1%; Packaging: Tape and Reel; Package Quantity: 10; Resistor Type: Thick Film; Number of Terminations: 2; Max Power Dissipation: 100mW; Voltage Rating (DC): 75V; Features: Automotive AEC-Q200; Series: CRCW; Construction: Rectangular; Resistance Tolerance: 1%; Length: 1.55mm; Width: 0.033inch; Height: 0.02inch; Depth: 0.85mm; REACH SVHC: Unknown; Military Standard: Not; Lead Free: Lead Free; RoHS Compliant: Yes; ComponentLink1URL: https://datasheet.ciiva.com/2525/dcrcwe3-2525254.pdf?src-supplier=Digi-Key; ComponentLink1Description: https://datasheet.ciiva.com/2525/dcrcwe3-2525254.pdf?src-supplier=Digi-Key; ComponentLink2URL: https://datasheet.ciiva.com/2525/dcrcwe3-2525255.pdf?src-supplier=Digi-Key; ComponentLink2Description: https://datasheet.ciiva.com/2525/dcrcwe3-2525255.pdf?src-supplier=Digi-Key; ComponentLink3URL: https://datasheet.ciiva.com/7748/1697337-7748679.pdf?src-supplier=Element14; ComponentLink3Description: https://datasheet.ciiva.com/7748/1697337-7748679.pdf?src-supplier=Element14; ComponentLink4URL: https://datasheet.ciiva.com/2525/dcrcwe3-2525256.pdf?src-supplier=Digi-Key; ComponentLink4Description: https://datasheet.ciiva.com/2525/dcrcwe3-2525256.pdf?src-supplier=Digi-Key; ComponentLink5URL: https://datasheet.ciiva.com/7748/1697337-7748680.pdf?src-supplier=Element14; ComponentLink5Description: https://datasheet.ciiva.com/7748/1697337-7748680.pdf?src-supplier=Element14; ComponentLink6URL: https://datasheet.ciiva.com/5546/dcrcwe3-109170-5546746.pdf?src-supplier=Mouser; ComponentLink6Description: https://datasheet.ciiva.com/5546/dcrcwe3-109170-5546746.pdf?src-supplier=Mouser; ComponentLink7URL: https://datasheet.ciiva.com/9065/dcrcwe3-9065258.pdf?src-supplier=Avnet; ComponentLink7Description: https://datasheet.ciiva.com/9065/dcrcwe3-9065258.pdf?src-supplier=Avnet; ComponentLink8URL: https://datasheet.ciiva.com/22700/1697337-22700634.pdf?src-supplier=Element14; ComponentLink8Description: https://datasheet.ciiva.com/22700/1697337-22700634.pdf?src-supplier=Element14; ComponentLink9URL: https://datasheet.ciiva.com/22675/1700796-22675468.pdf?src-supplier=Element14; ComponentLink9Description: https://datasheet.ciiva.com/22675/1700796-22675468.pdf?src-supplier=Element14; ComponentLink10URL: https://datasheet.ciiva.com/22675/1700796-22675469.pdf?src-supplier=Element14; ComponentLink10Description: https://datasheet.ciiva.com/22675/1700796-22675469.pdf?src-supplier=Element14; Supplier Part Number 1: 541-5.62MHCT-ND
R25 = RMCF0603FT100R: RES SMD 100 1%; Manufacturer: Stackpole Electronics; Resistance: 100R; Power Rating: 100mW; Temperature Coefficient: 100ppm/°C; Supplier 1: Digi-Key; Manufacturer Part Number: RMCF0603FT100R; RoHS: Yes; Category: Chip SMD Resistors; Stock 1: 1363320; Pricing 1: 1=0.10000, 10=0.01600, 100=0.00650, 1000=0.00292, 2500=0.00253 (USD); Mount: Surface Mount; Case/Package: 0603; Case Code (Metric): 1608; Case Code (Imperial): 0603; Contact Plating: Tin,Matte; Size Code: 0603; Min Operating Temperature: -55°C; Max Operating Temperature: 155°C; Tolerance: 1%; Packaging: Tape and Reel; Resistor Type: Thick Film; Number of Terminations: 2; Max Power Dissipation: 100mW; Features: Automotive AEC-Q200; Series: RMCF; Construction: Rectangular; Length: 1.55mm; Width: 0.031inch; Height: 0.022inch; Depth: 0.8mm; Radiation Hardening: No; Military Standard: Not; Lead Free: Lead Free; RoHS Compliant: Yes; ComponentLink1URL: https://datasheet.ciiva.com/15215/getdatasheetpartid-360413-15215981.pdf?src-supplier=Verical; ComponentLink1Description: https://datasheet.ciiva.com/15215/getdatasheetpartid-360413-15215981.pdf?src-supplier=Verical; Supplier Part Number 1: RMCF0603FT100RCT-ND
TP1 = Test Point